# EAGLE design board (EAGLE 7.2.0)
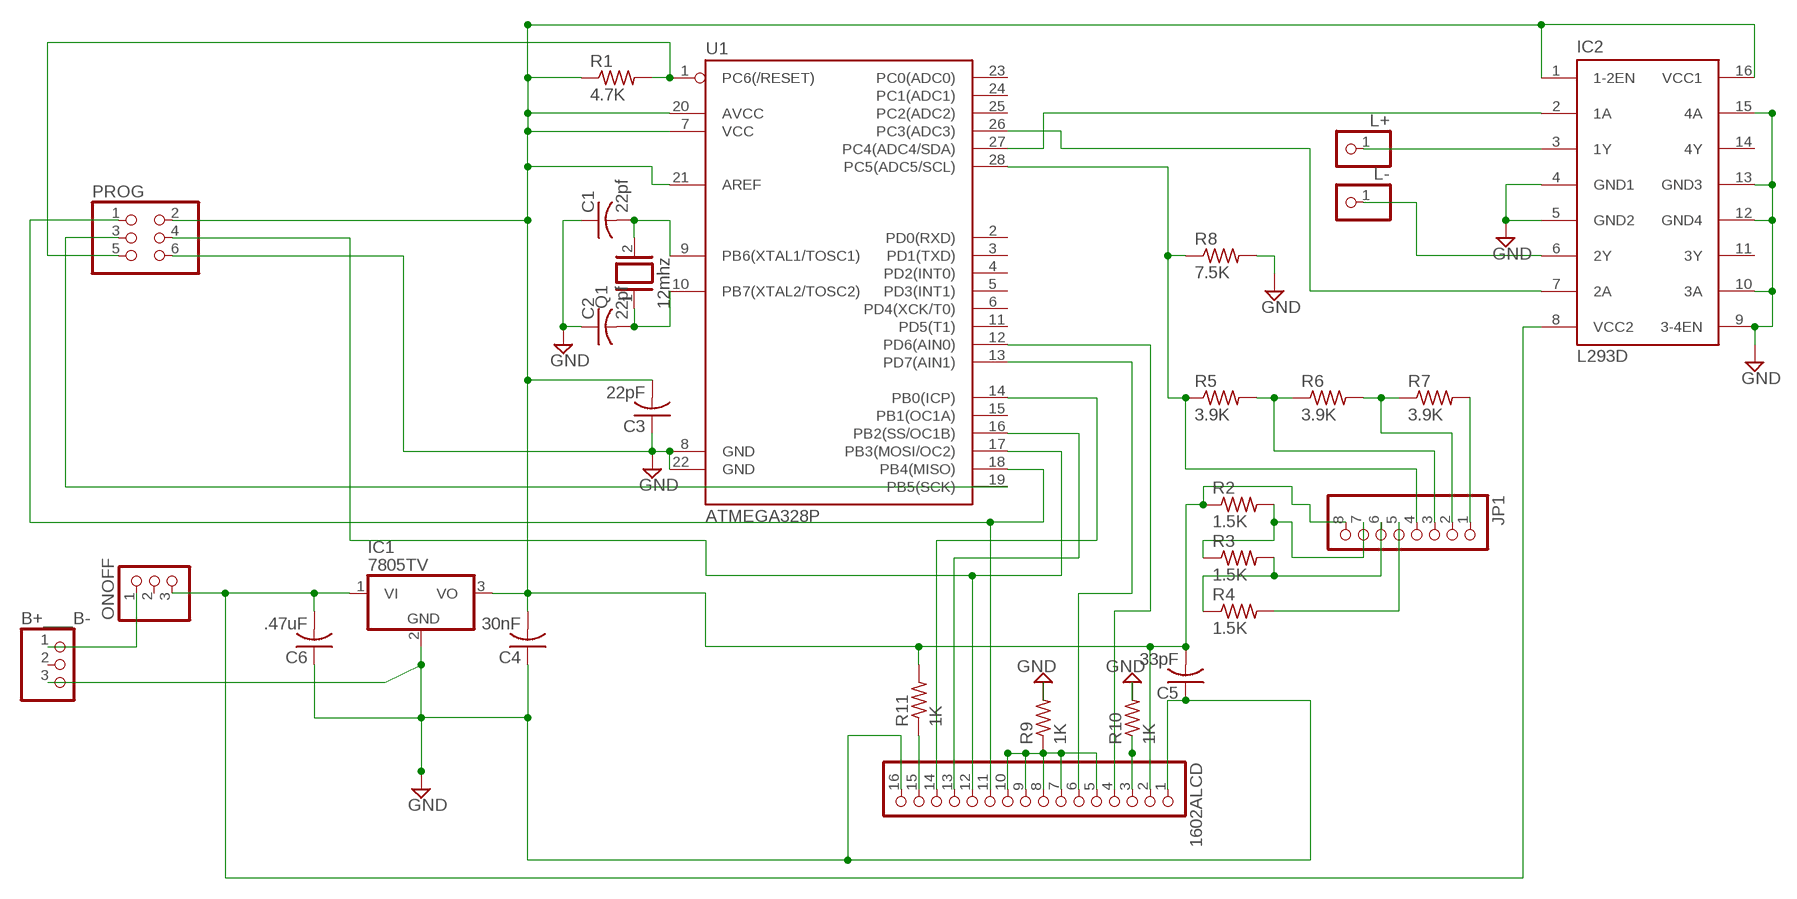
[diagram p0: schematic, sheet 1]

## Parts
1602ALCD  PINHD-1X16  [1X16]
B+___B-  PINHD-1X3  [1X03]
C1  22pf  C-US050-024X044  [C050-024X044]
C2  22pf  C-US050-024X044  [C050-024X044]
C3  22pF  C-US025-025X050  [C025-025X050]
C4  30nF  C-US025-025X050  [C025-025X050]
C5  33pF  C-US025-025X050  [C025-025X050]
C6  .47uF  C-US025-025X050  [C025-025X050]
IC1  7805TV  [TO220V]
IC2  L293D  [DIL16]
JP1  PINHD-1X8  [1X08]
L+  PINHD-1X1  [1X01]
L-  PINHD-1X1  [1X01]
ONOFF  PINHD-1X3  [1X03]
PROG  PINHD-2X3  [2X03]
Q1  12mhz  XTAL/S  [QS]
R1  4.7K  R-US_0207/7  [0207/7]
R2  1.5K  R-US_0207/7  [0207/7]
R3  1.5K  R-US_0207/7  [0207/7]
R4  1.5K  R-US_0207/7  [0207/7]
R5  3.9K  R-US_0207/7  [0207/7]
R6  3.9K  R-US_0207/7  [0207/7]
R7  3.9K  R-US_0207/7  [0207/7]
R8  7.5K  R-US_0207/7  [0207/7]
R9  1K  R-US_0207/7  [0207/7]
R10  1K  R-US_0207/7  [0207/7]
R11  1K  R-US_0207/7  [0207/7]
U1  ATMEGA328P  ATMEGA328P_PDIP  [DIL28-3]

## Nets
GND: 1602ALCD.1 1602ALCD.16 B+___B-.3 C1.1 C2.1 C3.1 C4.1 C5.1 C6.1 IC1.2(GND) IC2.4(GND1) IC2.5(GND2) IC2.9(3-4EN) IC2.10(3A) IC2.12(GND4) IC2.13(GND3) IC2.15(4A) PROG.6 R8.2 R9.2 R10.2 U1.8(GND) U1.22(GND)
N$1: 1602ALCD.2 C3.2 C4.2 C5.2 IC1.3(VO) IC2.1(1-2EN) IC2.16(VCC1) JP1.8 PROG.2 R1.1 R2.1 R11.2 U1.7(VCC) U1.20(AVCC) U1.21(AREF)
N$2: B+___B-.1 ONOFF.1
N$3: C6.2 IC1.1(VI) IC2.8(VCC2) ONOFF.3
N$4: C2.2 Q1.1 U1.10(PB7(XTAL2/TOSC2))
N$5: C1.2 Q1.2 U1.9(PB6(XTAL1/TOSC1))
N$6: PROG.5 R1.2 U1.1(PC6(/RESET))
N$7: JP1.4 R5.1 R8.1 U1.28(PC5(ADC5/SCL))
N$8: JP1.3 R5.2 R6.1
N$9: JP1.2 R6.2 R7.1
N$10: JP1.1 R7.2
N$11: IC2.7(2A) U1.26(PC3(ADC3))
N$12: JP1.5 R4.2
N$13: JP1.6 R3.2 R4.1
N$14: JP1.7 R2.2 R3.1
N$15: 1602ALCD.14 U1.14(PB0(ICP))
N$16: 1602ALCD.13 U1.16(PB2(SS/OC1B))
N$17: IC2.2(1A) U1.27(PC4(ADC4/SDA))
N$18: 1602ALCD.11 PROG.1 U1.18(PB4(MISO))
N$19: 1602ALCD.5 1602ALCD.7 1602ALCD.8 1602ALCD.9 1602ALCD.10 R9.1
N$20: 1602ALCD.6 U1.13(PD7(AIN1))
N$21: 1602ALCD.3 R10.1
N$22: 1602ALCD.4 U1.12(PD6(AIN0))
N$23: PROG.3 U1.19(PB5(SCK))
N$24: 1602ALCD.15 R11.1
N$25: 1602ALCD.12 PROG.4 U1.17(PB3(MOSI/OC2))
N$27: IC2.3(1Y) L+.1
N$28: IC2.6(2Y) L-.1
Unconnected: B+___B-.2 IC2.11(3Y) IC2.14(4Y) ONOFF.2 U1.2(PD0(RXD)) U1.3(PD1(TXD)) U1.4(PD2(INT0)) U1.5(PD3(INT1)) U1.6(PD4(XCK/T0)) U1.11(PD5(T1)) U1.15(PB1(OC1A)) U1.23(PC0(ADC0)) U1.24(PC1(ADC1)) U1.25(PC2(ADC2))

## Library data of the parts
1602ALCD = pinhead:PINHD-1X16: PIN HEADER
B+___B- ONOFF = pinhead:PINHD-1X3: PIN HEADER
C1 C2 = rcl:C-US: CAPACITOR, American symbol
C3-C6 = resistor:C-US: CAPACITOR, American symbol
IC1 = linear:78*: Positive VOLTAGE REGULATOR Source: http://cache.national.com/ds/LM/LM78L05.pdf http://www.fairchildsemi.com/ds/LM/LM7805.pdf
IC2 = st-microelectronics:L293D: PUSH-PULL 4 CHANNEL DRIVER; MPN: L293D; OC_FARNELL: 9589619; OC_NEWARK: 56P8249
JP1 = pinhead:PINHD-1X8: PIN HEADER
L+ L- = pinhead:PINHD-1X1: PIN HEADER
PROG = pinhead:PINHD-2X3: PIN HEADER
Q1 = special:XTAL/S: CRYSTAL
R1-R11 = resistor:R-US_: RESISTOR, American symbol
U1 = SparkFun-DigitalIC:ATMEGA328P_PDIP: uC used in the Arduino 32kb flash, 1k EEPROM, 2k SRAM This is the through-hole version of this chip.

## Board
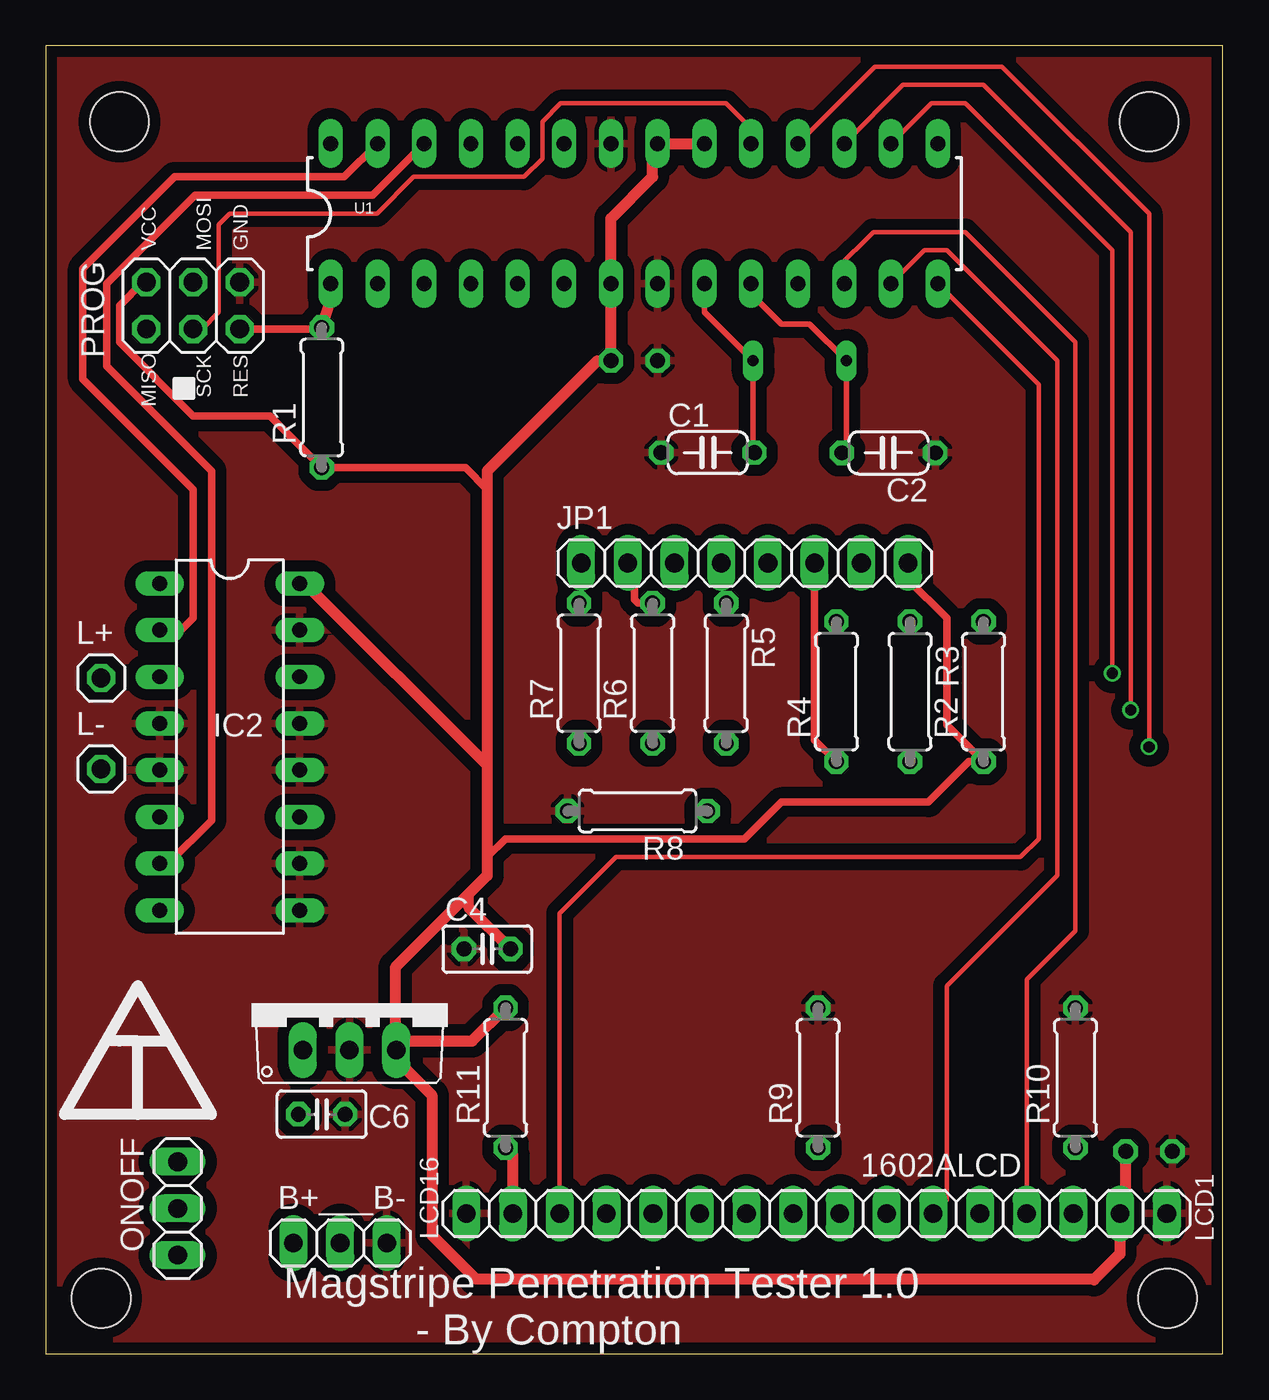
[diagram p1: board, top side]
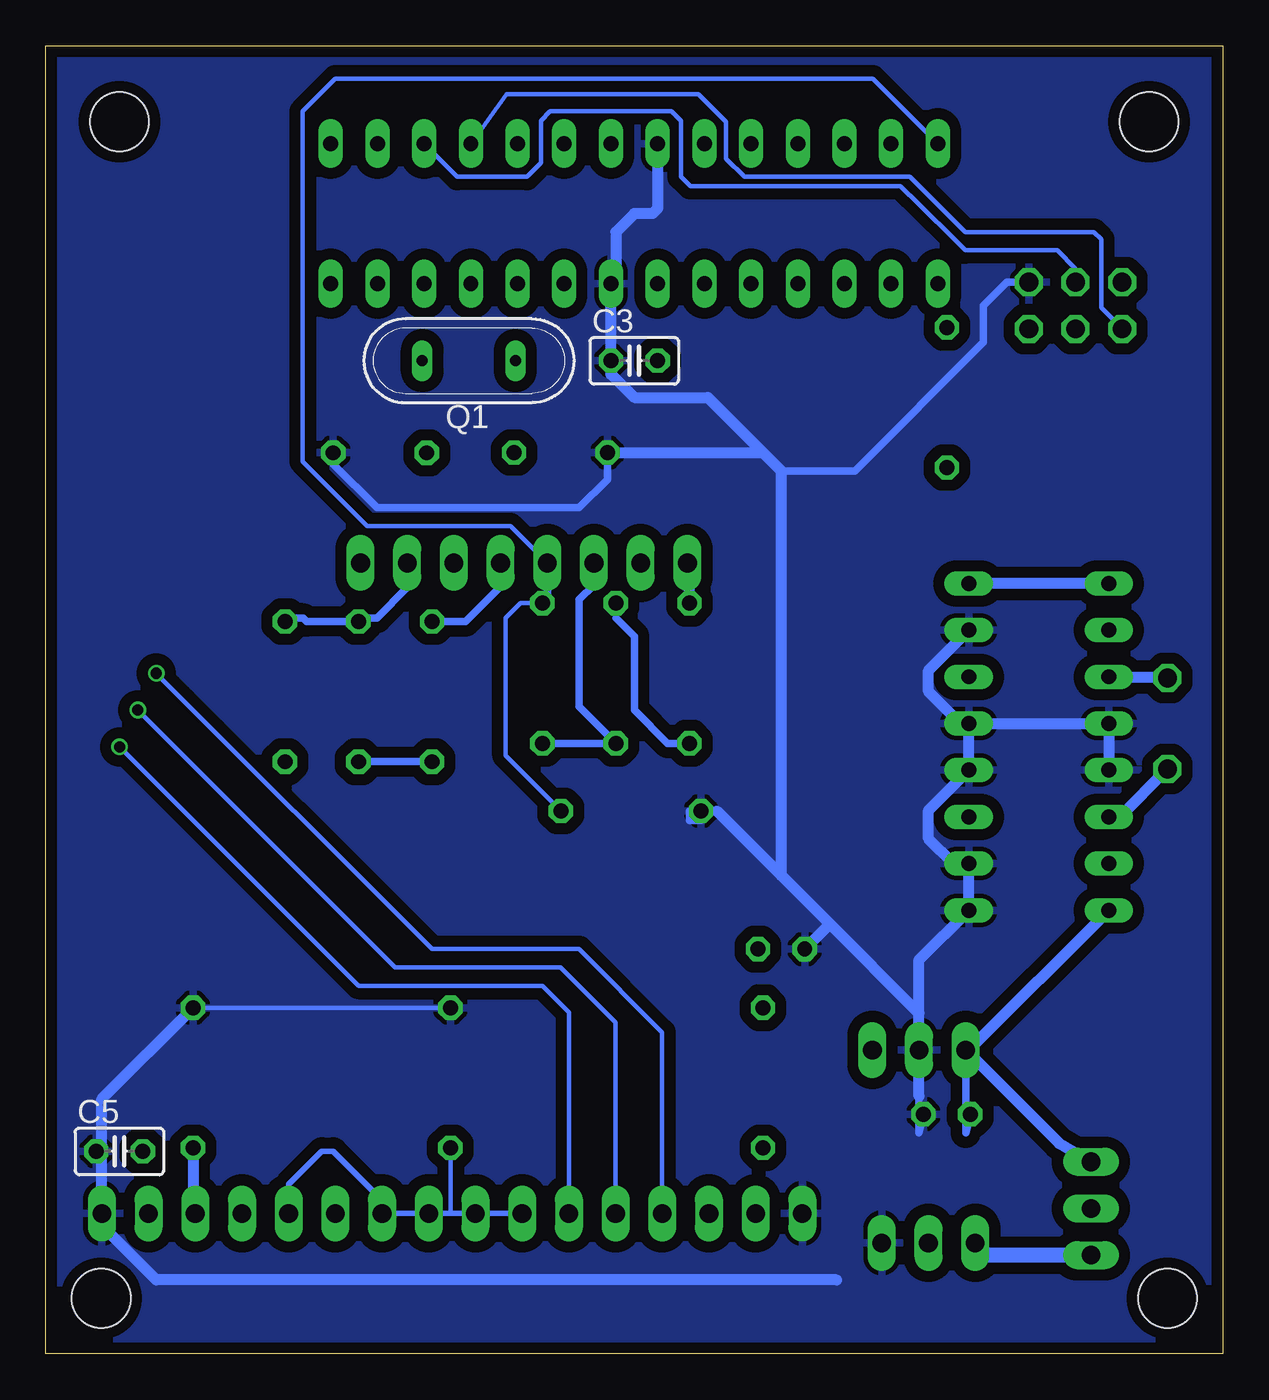
[diagram p2: board, bottom side, seen from below]

Size 64 x 71.12 mm. Coordinates in mm from the lower left corner, seen from the top.
Outline: 0,0 64,0 64,71.12 0,71.12 0,0
Copper layers (1*16): Top 0.035mm / dielectric 1.5mm / Bottom 0.035mm
Design rules "MakerStudio": minimum track width 6mil, minimum drill 12mil, track to track 6mil, track to pad 6mil, pad to pad 6mil, via to via 6mil, smd to smd 0mil, copper to edge 10mil, drill to drill 10mil, minimum pad ring 10mil, minimum via ring 6mil, stop-mask expansion 2mil, vias tented up to drill 100mil, thermal gap 10mil
Holes 3.2 mm at 60,67 3,3 4,67 61,3

### Footprints (pad centres in the part's own frame; a part is rotated, then mirrored left to right if it is on the bottom)
1X16 = drill 1.016 long: 1 -19.05,0; 2 -16.51,0; 3 -13.97,0; 4 -11.43,0; 5 -8.89,0; 6 -6.35,0; 7 -3.81,0; 8 -1.27,0; 9 1.27,0; 10 3.81,0; 11 6.35,0; 12 8.89,0; 13 11.43,0; 14 13.97,0; 15 16.51,0; 16 19.05,0
1X03 = drill 1.016 long: 1 -2.54,0; 2 0,0; 3 2.54,0
C050-024X044 = drill 0.813 octagon: 1 -2.54,0; 2 2.54,0
C025-025X050 = drill 0.813 octagon: 1 -1.27,0; 2 1.27,0
TO220V = drill 1.016 long: 1 -2.54,-2.54; 2 0,-2.54; 3 2.54,-2.54
DIL16 = drill 0.813 long: 1 -8.89,-3.81; 2 -6.35,-3.81; 3 -3.81,-3.81; 4 -1.27,-3.81; 5 1.27,-3.81; 6 3.81,-3.81; 7 6.35,-3.81; 8 8.89,-3.81; 9 8.89,3.81; 10 6.35,3.81; 11 3.81,3.81; 12 1.27,3.81; 13 -1.27,3.81; 14 -3.81,3.81; 15 -6.35,3.81; 16 -8.89,3.81
1X08 = drill 1.016 long: 1 -8.89,0; 2 -6.35,0; 3 -3.81,0; 4 -1.27,0; 5 1.27,0; 6 3.81,0; 7 6.35,0; 8 8.89,0
1X01 = drill 1.016 octagon: 1 0,0
2X03 = drill 1.016 octagon: 1 -2.54,-1.27; 2 -2.54,1.27; 3 0,-1.27; 4 0,1.27; 5 2.54,-1.27; 6 2.54,1.27
QS = drill 0.61 long: 1 -2.54,0; 2 2.54,0
0207/7 = drill 0.813 octagon: 1 -3.81,0; 2 3.81,0
DIL28-3 = drill 0.813 long: 1 -16.51,-3.81; 2 -13.97,-3.81; 3 -11.43,-3.81; 4 -8.89,-3.81; 5 -6.35,-3.81; 6 -3.81,-3.81; 7 -1.27,-3.81; 8 1.27,-3.81; 9 3.81,-3.81; 10 6.35,-3.81; 11 8.89,-3.81; 12 11.43,-3.81; 13 13.97,-3.81; 14 16.51,-3.81; 15 16.51,3.81; 16 13.97,3.81; 17 11.43,3.81; 18 8.89,3.81; 19 6.35,3.81; 20 3.81,3.81; 21 1.27,3.81; 22 -1.27,3.81; 23 -3.81,3.81; 24 -6.35,3.81; 25 -8.89,3.81; 26 -11.43,3.81; 27 -13.97,3.81; 28 -16.51,3.81

### Placement (x,y rotation side)
1602ALCD  41.91,7.62 180 top
B+___B-  16,6.02 0 top
C1  36,49 0 top
C2  45.83,48.99 180 top
C3  32,54 0 bottom
C4  24,22 0 top
C5  60,11 0 bottom
C6  15,13.02 180 top
IC1  16.51,19.05 0 top
IC2  10,33 270 top
JP1  38,43 0 top
L+  3,36.75 0 top
L-  3,31.79 0 top
ONOFF  7.16,7.89 90 top
PROG  8,57 0 top
Q1  41,54 0 bottom
R1  15,52 90 top
R2  51,36 90 top
R3  47,36 270 top
R4  43,36 90 top
R5  37,37 270 top
R6  33,37 90 top
R7  29,37 90 top
R8  32.18,29.51 180 top
R9  42,15 90 top
R10  56,15 90 top
R11  25,15 90 top
U1  32,62 0 top

### Tracks (layer width: path | path; a pad name or v marks a point on that pad's centre or on a via)
GND
  Bottom 0.254: R9.2 R10.2
  Bottom 0.406: C1.1 33.46,47.54 35,46 46,46 48.37,48.37 C2.1 | 27.51,29.51 R8.2 | R8.2 29,29.51 29,29 28.37,29 R8.2 | PROG.6 11.73,58.27 13,57 13,55 20,48 24,48 | C6.1 16.51,12 16.51,14
  Bottom 0.61: 16.51,14 IC1.2 16.51,18.51 | 16.51,18.51 21.5,23.5 | 21.5,23.5 24,26 | 24,26 24,48 25,49 | 27.51,29.51 24,26 | C1.1 25,49 | 25,49 28,52 32,52 33.27,53.27 C3.1 U1.8 33,58.46 33,61 32,62 31,62 30.73,62.27 U1.22 | 60.96,11.31 1602ALCD.1 61,7.58 61,7 58,4 21,4 | 60.96,11.31 60.96,13.85 R10.2 | 1602ALCD.16 22.62,7.62 | 16.51,18.51 16.51,21.41 IC2.9 IC2.10 14.65,26.65 16,28 16,29.54 IC2.12 IC2.13 | IC2.13 IC2.4 6.19,32.19 6,32 6,31.92 IC2.5 | IC2.13 14.27,34.27 16,36 16,37.16 IC2.15 | C4.1 21.5,23.23 21.5,23.5 | C5.1 60.96,11.31
  pour Top (isolate 0.61): 64,71 0,71 0,0 64,0
  pour Bottom (isolate 0.61): 0,71 64,71 64,0 0,0 0,8
N$1
  Top 0.406: 24,27 25,28 38,28 40,30 48,30 50.19,32.19 R2.1 49,34.19 49,40 46.89,42.11 JP1.8 | 24,47 22.81,48.19 R1.1 12.19,51 8,51 4,55 4,57 5.27,58.27 PROG.2
  Top 0.61: IC1.3 19.05,16 | 58.42,6.35 1602ALCD.2 | 24,32 24,47 24,48 30,54 C3.2 U1.7 30.73,61.73 33,64 33,66.54 U1.21 U1.20 | 24,32 24,27 24,26 23,25 | 23,25 19,21 19,17 | 19,17 19,16.05 19.05,16 | 1602ALCD.2 58.42,5.42 57,4 56.94,4.06 23.37,4.06 21,6.43 21,14.05 19.05,16 | 19,17 23.19,17 R11.2 | IC2.16 14.11,41.89 24,32 | C4.2 23,24.27 23,25 | 1602ALCD.2 58.73,7.93 C5.2
  Bottom 0.61: IC2.1 IC2.16
N$2
  Bottom 0.813: ONOFF.1 12.79,5.35 B+___B-.1
N$3
  Bottom 0.406: C6.2 13.97,12 IC1.1
  Bottom 0.61: ONOFF.3 8.89,11.43 IC1.1 13.79,16.51 IC2.8
N$4
  Top 0.305: U1.10 38.35,57.65 40,56 41.54,56 Q1.1 43.54,49.24 C2.2
N$5
  Top 0.305: C1.2 38.46,49.08 Q1.2 35.81,56.65 U1.9
N$6
  Top 0.406: PROG.5 14.92,55.73 R1.2
  Top 0.61: U1.1 15.49,57.32 R1.2
N$7
  Bottom 0.254: JP1.4 38.73,45 46.52,45 50.04,48.51 50.04,67.56 48.26,69.34 19.02,69.34 U1.28 | R8.1 39,32.52 39,40 38.19,40.81 R5.1
  Bottom 0.406: JP1.4 36.73,41.08 R5.1
N$8
  Bottom 0.406: R5.2 R6.1 35,35.19 35,41 34.19,41.81 JP1.3
N$9
  Top 0.406: R6.2 32.19,40.81 32,41 32,42.65 JP1.2
  Bottom 0.254: 33,40 R6.2
  Bottom 0.406: R7.1 30.19,33.19 32,35 32,39 33,40
N$10
  Bottom 0.61: R7.2 29,42.89 JP1.1
N$11
  Top 0.406: IC2.7 6.65,26.65 9,29 9,48 3.3,53.7 3.3,58.18 8.12,63 17.76,63 U1.26
N$12
  Bottom 0.406: R4.2 41.19,39.81 39,42 39,42.73 JP1.5
N$13
  Top 0.406: JP1.6 41.81,33.38 R4.1
  Bottom 0.406: R3.2 R4.1
N$14
  Bottom 0.406: R2.2 50.81,40 50,40 49.81,39.81 R3.1 46.81,40 46,40 44.35,41.65 JP1.7
N$15
  Top 0.254: U1.14 54,52.7 54,28 53,27 31,27 27.94,23.94 1602ALCD.14
N$16  (via drill 0.6)
  Top 0.254: U1.16 48.16,68 50,68 58,60 v58,37
  Bottom 0.254: v58,37 43,22 35,22 30.48,17.48 1602ALCD.13
N$17
  Top 0.406: IC2.2 7.35,39.35 8,40 8,47 2,53 2,59 7,64 16.22,64 U1.27
N$18  (via drill 0.6)
  Top 0.254: U1.18 45.08,70 52,70 60,62 v60,33
  Bottom 0.254: 5.27,55.73 PROG.1 5.46,55.75 6.6,56.9 6.6,60.6 7,61 14,61 17,64 26,64 27,65 27,67 28.51,68.51 38.95,68.51 U1.18 | v60,33 47,20 37,20 35.56,18.56 1602ALCD.11
N$19
  Bottom 0.254: R9.1 42,7.62
  Bottom 0.305: 1602ALCD.10 1602ALCD.9 42,7.62 1602ALCD.8 45,7.62 | 45,7.62 1602ALCD.7 | 1602ALCD.5 50.8,9.2 49,11 48.38,11 45,7.62
N$20
  Top 0.254: 1602ALCD.6 49,8.36 49,20 55,26 55,54 49,60 47.78,60 U1.13
N$21
  Bottom 0.61: R10.1 56,7.74 1602ALCD.3
N$22
  Top 0.254: U1.12 43,58.62 43,59 45,61 50,61 56,55 56,23 53.34,20.34 1602ALCD.4
N$23
  Top 0.254: U1.19 38.35,66.65 37,68 28,68 27,67 27,65 26,64 20,64 18,62 10,62 9.4,61.4 9.4,56.64 8.49,55.73 PROG.3
N$24
  Top 0.61: 1602ALCD.15 25.4,10.79 R11.1
N$25  (via drill 0.6)
  Top 0.254: U1.17 46.62,69 51,69 59,61 v59,35
  Bottom 0.254: PROG.4 8,59 9,60 14,60 17,63 17.03,63 17.53,63.5 28.96,63.5 29.46,64.01 29.46,67.06 29.97,67.56 36.58,67.56 37.08,67.06 37.08,64.77 37.85,64.01 41.63,64.01 U1.17 | v59,35 45,21 36,21 33.02,18.02 1602ALCD.12
N$27
  Bottom 0.61: IC2.3 3,36.81 L+.1
N$28
  Bottom 0.61: IC2.6 5.6,29.19 L-.1

### Text on the board
tNames: VCC | MOSI | GND | MISO | SCK | RES | LCD16 | LCD1 | Magstripe Penetration Tester 1.0 / - By Compton